# EAGLE design 68000_afterWireing (EAGLE 7.6.0)
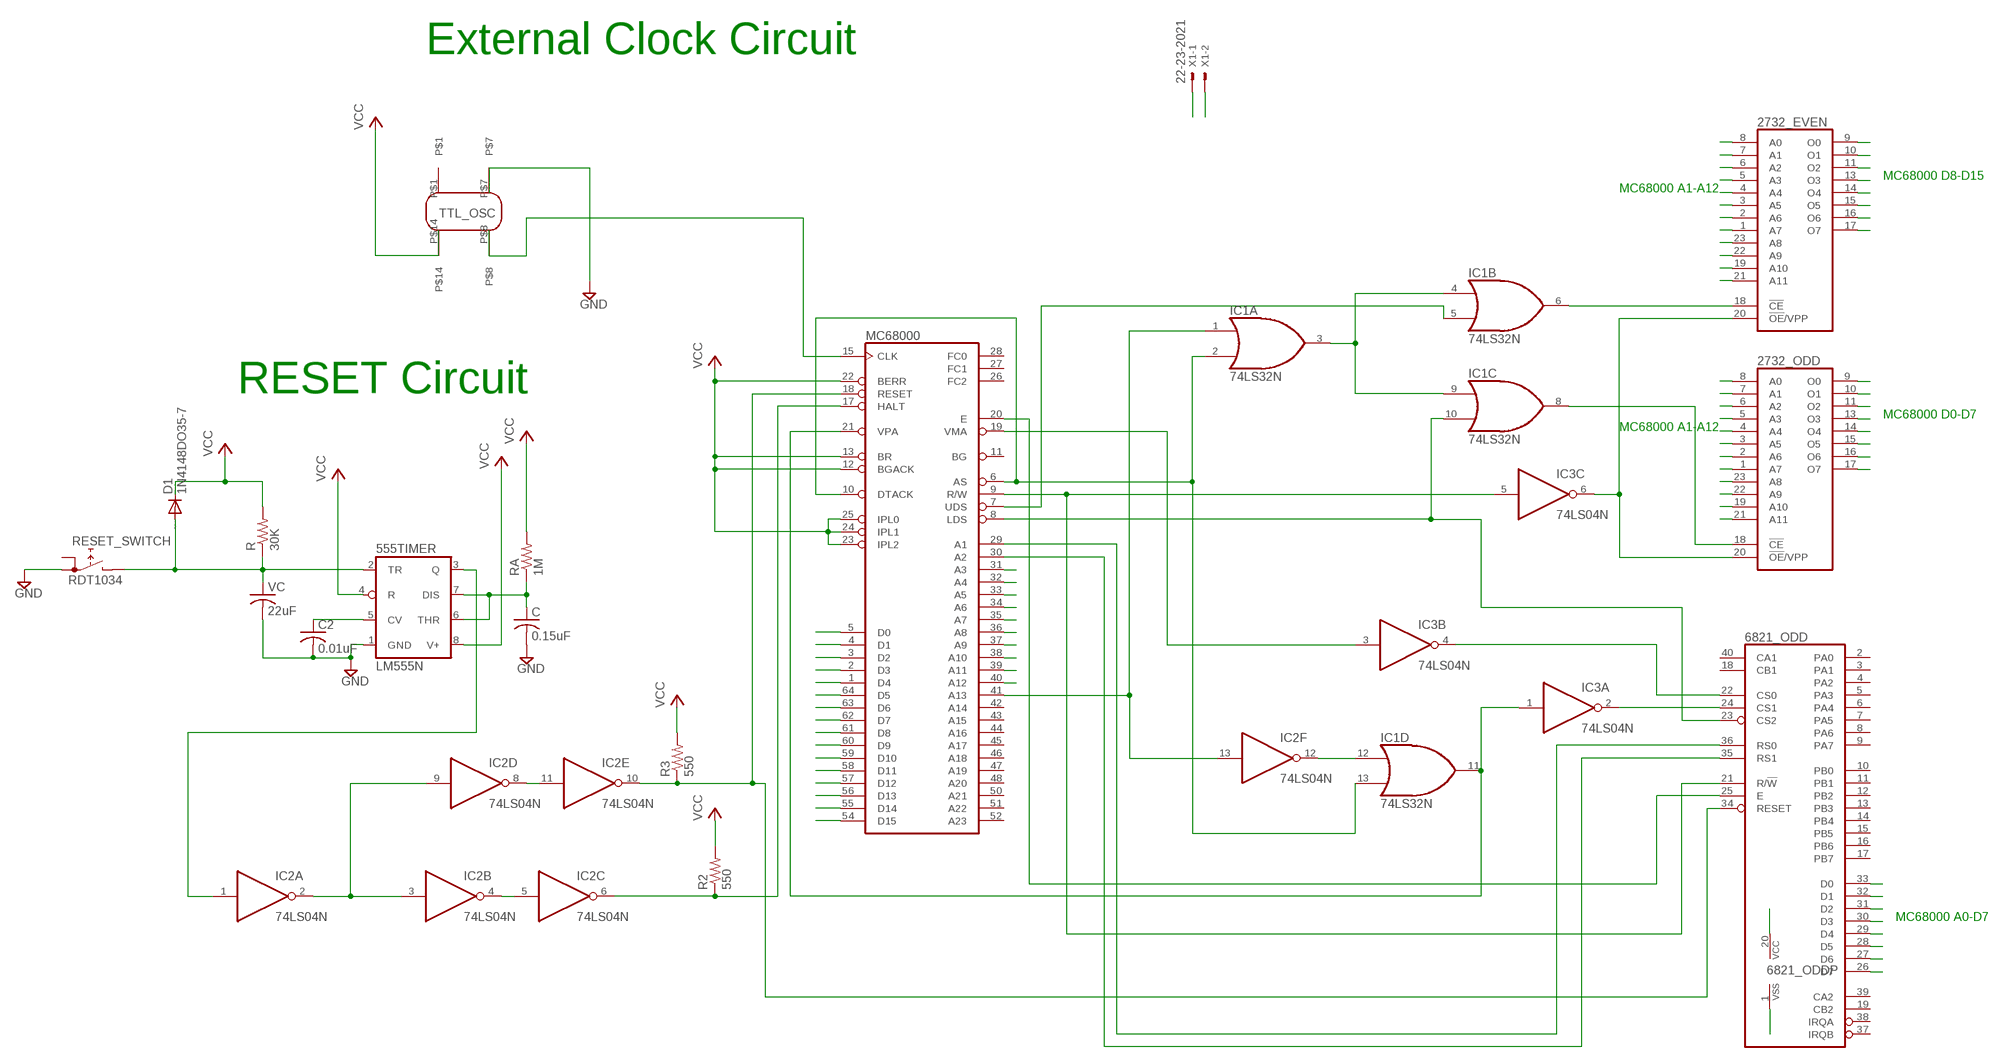
[diagram p0: schematic, sheet 1]

## Parts
555TIMER  LM555N  [DIL08]
2732_EVEN  2732  [DIL24]
2732_ODD  2732  [DIL24]
6821_ODD  6821  [DIL40]
C  0.15uF  C-US025-024X044  [C025-024X044]
C2  0.01uF  C-US025-024X044  [C025-024X044]
D1  1N4148DO35-7  [DO35-7]
IC1  74LS32N  [DIL14]
IC2  74LS04N  [DIL14]
IC3  74LS04N  [DIL14]
MC68000  MC68000P  [DIL64]
R  30K  R-US_0204/2V  [0204V]
R2  550  R-US_0204/2V  [0204V]
R3  550  R-US_0204/2V  [0204V]
RA  1M  R-US_0204/2V  [0204V]
RESET_SWITCH  RDT1034  [RDT1034]
U$1  TTL_OSCILLATOR  [TTL_OSCILLATOR]
VC  22uF  C-US025-024X044  [C025-024X044]
X1  22-23-2021  [22-23-2021]

## Nets
A1: 2732_EVEN.8(A0) 2732_ODD.8(A0) 6821_ODD.36(RS0) MC68000.29(A1)
A2: 2732_EVEN.7(A1) 2732_ODD.7(A1) 6821_ODD.35(RS1) MC68000.30(A2)
A3: 2732_EVEN.6(A2) 2732_ODD.6(A2) MC68000.31(A3)
A4: 2732_EVEN.5(A3) 2732_ODD.5(A3) MC68000.32(A4)
A5: 2732_EVEN.4(A4) 2732_ODD.4(A4) MC68000.33(A5)
A6: 2732_EVEN.3(A5) 2732_ODD.3(A5) MC68000.34(A6)
A7: 2732_EVEN.2(A6) 2732_ODD.2(A6) MC68000.35(A7)
A8: 2732_EVEN.1(A7) 2732_ODD.1(A7) MC68000.36(A8)
A9: 2732_EVEN.23(A8) 2732_ODD.23(A8) MC68000.37(A9)
A10: 2732_EVEN.22(A9) 2732_ODD.22(A9) MC68000.38(A10)
A11: 2732_EVEN.19(A10) 2732_ODD.19(A10) MC68000.39(A11)
A12: 2732_EVEN.21(A11) 2732_ODD.21(A11) MC68000.40(A12)
D0: 2732_ODD.9(O0) 6821_ODD.33(D0) MC68000.5(D0)
D1: 2732_ODD.10(O1) 6821_ODD.32(D1) MC68000.4(D1)
D2: 2732_ODD.11(O2) 6821_ODD.31(D2) MC68000.3(D2)
D3: 2732_ODD.13(O3) 6821_ODD.30(D3) MC68000.2(D3)
D4: 2732_ODD.14(O4) 6821_ODD.29(D4) MC68000.1(D4)
D5: 2732_ODD.15(O5) 6821_ODD.28(D5) MC68000.64(D5)
D6: 2732_ODD.16(O6) 6821_ODD.27(D6) MC68000.63(D6)
D7: 2732_ODD.17(O7) 6821_ODD.26(D7) MC68000.62(D7)
D8: 2732_EVEN.9(O0) MC68000.61(D8)
D9: 2732_EVEN.10(O1) MC68000.60(D9)
D10: 2732_EVEN.11(O2) MC68000.59(D10)
D11: 2732_EVEN.13(O3) MC68000.58(D11)
D12: 2732_EVEN.14(O4) MC68000.57(D12)
D13: 2732_EVEN.15(O5) MC68000.56(D13)
D14: 2732_EVEN.16(O6) MC68000.55(D14)
D15: 2732_EVEN.17(O7) MC68000.54(D15)
GND [ground]: 555TIMER.1(GND) 6821_ODD.1(VSS) C2.2 C.2 RESET_SWITCH.A1 U$1.P$7 VC.2 X1.2
N$1: 6821_ODD.21(R/!W) IC3.5(C:I) MC68000.9(R/W)
N$2: 6821_ODD.24(CS1) IC3.2(A:O)
N$3: IC1.1(A:I0) IC2.13(F:I) MC68000.41(A13)
N$4: IC1.3(A:O) IC1.4(B:I0) IC1.9(C:I0)
N$5: 2732_EVEN.20(!OE!/VPP) 2732_ODD.20(!OE!/VPP) IC3.6(C:O)
N$6: 6821_ODD.25(E) MC68000.20(E)
N$8: IC1.5(B:I1) MC68000.7(UDS)
N$9: 6821_ODD.23(CS2) IC1.10(C:I1) MC68000.8(LDS)
N$10: IC1.2(A:I1) IC1.13(D:I1) MC68000.6(AS) MC68000.10(DTACK)
N$11: 6821_ODD.22(CS0) IC3.4(B:O)
N$12: IC3.3(B:I) MC68000.19(VMA)
N$13: IC1.12(D:I0) IC2.12(F:O)
N$14: IC1.11(D:O) IC3.1(A:I) MC68000.21(VPA)
N$15: 555TIMER.5(CV) C2.1
N$16: 555TIMER.2(TR) D1.A R.1 RESET_SWITCH.B VC.1
N$17: 2732_EVEN.18(!CE) IC1.6(B:O)
N$18: 555TIMER.6(THR) 555TIMER.7(DIS) C.1 RA.1
N$19: 555TIMER.3(Q) IC2.1(A:I)
N$20: IC2.4(B:O) IC2.5(C:I)
N$21: IC2.6(C:O) MC68000.17(HALT) R2.1
N$22: 6821_ODD.34(RESET) IC2.10(E:O) MC68000.18(RESET) R3.1
N$23: 2732_ODD.18(!CE) IC1.8(C:O)
N$26: MC68000.15(CLK) U$1.P$8
N$27: IC2.2(A:O) IC2.3(B:I) IC2.9(D:I)
N$28: IC2.8(D:O) IC2.11(E:I)
VCC [ground]: 555TIMER.4(R) 555TIMER.8(V+) 6821_ODD.20(VCC) D1.C MC68000.12(BGACK) MC68000.13(BR) MC68000.22(BERR) MC68000.23(IPL2) MC68000.24(IPL1) MC68000.25(IPL0) R2.2 R3.2 R.2 RA.2 U$1.P$14 X1.1
Unconnected: 6821_ODD.2(PA0) 6821_ODD.3(PA1) 6821_ODD.4(PA2) 6821_ODD.5(PA3) 6821_ODD.6(PA4) 6821_ODD.7(PA5) 6821_ODD.8(PA6) 6821_ODD.9(PA7) 6821_ODD.10(PB0) 6821_ODD.11(PB1) 6821_ODD.12(PB2) 6821_ODD.13(PB3) 6821_ODD.14(PB4) 6821_ODD.15(PB5) 6821_ODD.16(PB6) 6821_ODD.17(PB7) 6821_ODD.18(CB1) 6821_ODD.19(CB2) 6821_ODD.37(IRQB) 6821_ODD.38(IRQA) 6821_ODD.39(CA2) 6821_ODD.40(CA1) IC3.8(D:O) IC3.9(D:I) IC3.10(E:O) IC3.11(E:I) IC3.12(F:O) IC3.13(F:I) MC68000.11(BG) MC68000.26(FC2) MC68000.27(FC1) MC68000.28(FC0) MC68000.42(A14) MC68000.43(A15) MC68000.44(A16) MC68000.45(A17) MC68000.46(A18) MC68000.47(A19) MC68000.48(A20) MC68000.50(A21) MC68000.51(A22) MC68000.52(A23) RESET_SWITCH.A U$1.P$1

## Notes on the sheet
- External Clock Circuit
- MC68000 D8-D15
- MC68000 A1-A12
- RESET Circuit
- MC68000 D0-D7
- MC68000 A1-A12
- MC68000 A0-D7

## Power pins joined to a net without a drawn wire
GND: 2732_EVEN.12(GND) 2732_ODD.12(GND) IC1.7(P:GND) IC2.7(P:GND) IC3.7(P:GND) MC68000.16(GND) MC68000.53(GND)
VCC: 2732_EVEN.24(VCC) 2732_ODD.24(VCC) IC1.14(P:VCC) IC2.14(P:VCC) IC3.14(P:VCC) MC68000.14(VCC) MC68000.49(VCC)

## Library data of the parts
555TIMER = linear:*555: TIMER
2732_EVEN 2732_ODD = memory:2732: MEMORY
6821_ODD = micro-motorola:6821: MICROCONTROLLER/MEMORY DEVICE; MF: NTE ELECTRONICS; MPN: NTE6821; OC_FARNELL: 1652403; OC_NEWARK: 29C4772
C C2 VC = rcl:C-US: CAPACITOR, American symbol
D1 = diode:1N4148: DIODE high speed (Philips)
IC1 = 74xx-us:74*32: Quad 2-input OR gate
IC2 IC3 = 74xx-us:74*04: Hex INVERTER
MC68000 = micro-mc68000:MC68000P: 68xxx PROCESSOR; OC_FARNELL: unknown; OC_NEWARK: unknown
R R2 R3 RA = resistor:R-US_: RESISTOR, American symbol
RESET_SWITCH = switch:RDT1034: PUSH SWITCH www.radiohm.com
U$1 = TTL_OSCILLATOR:TTL_OSCILLATOR
X1 = con-molex:22-23-2021: .100" (2.54mm) Center Header - 2 Pin; MF: MOLEX; MPN: 22-23-2021; OC_FARNELL: 1462926; OC_NEWARK: 25C3832

## Net classes
0 default: width 0.406 mm
1 ground: width 0.61 mm

## Board
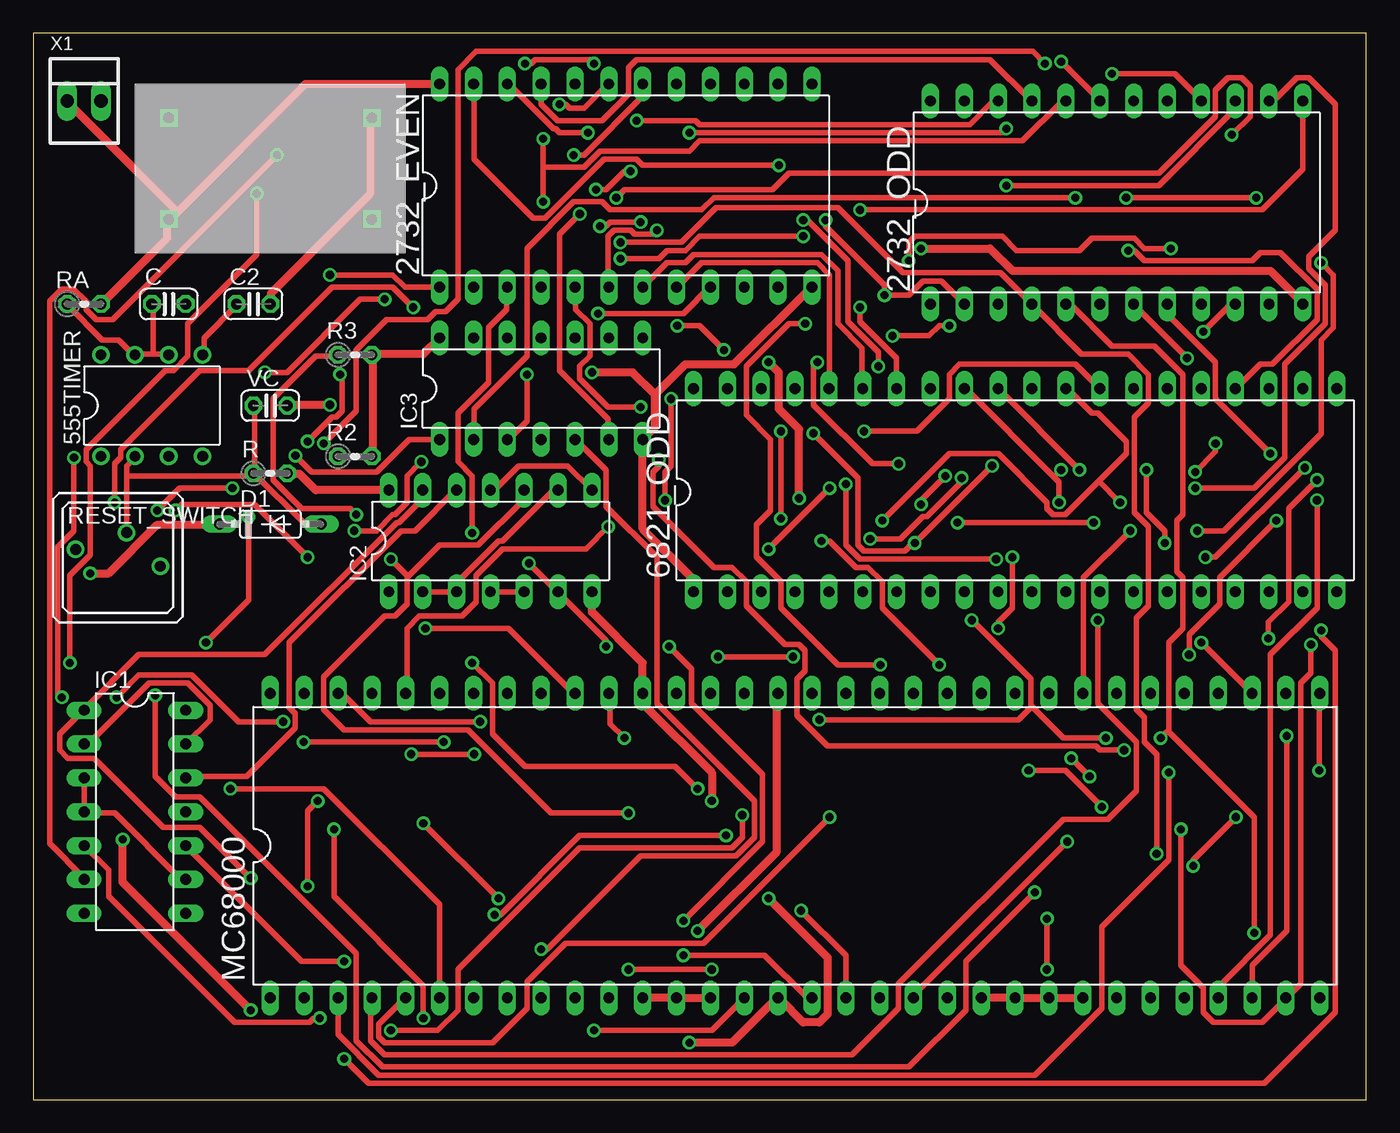
[diagram p1: board, top side]
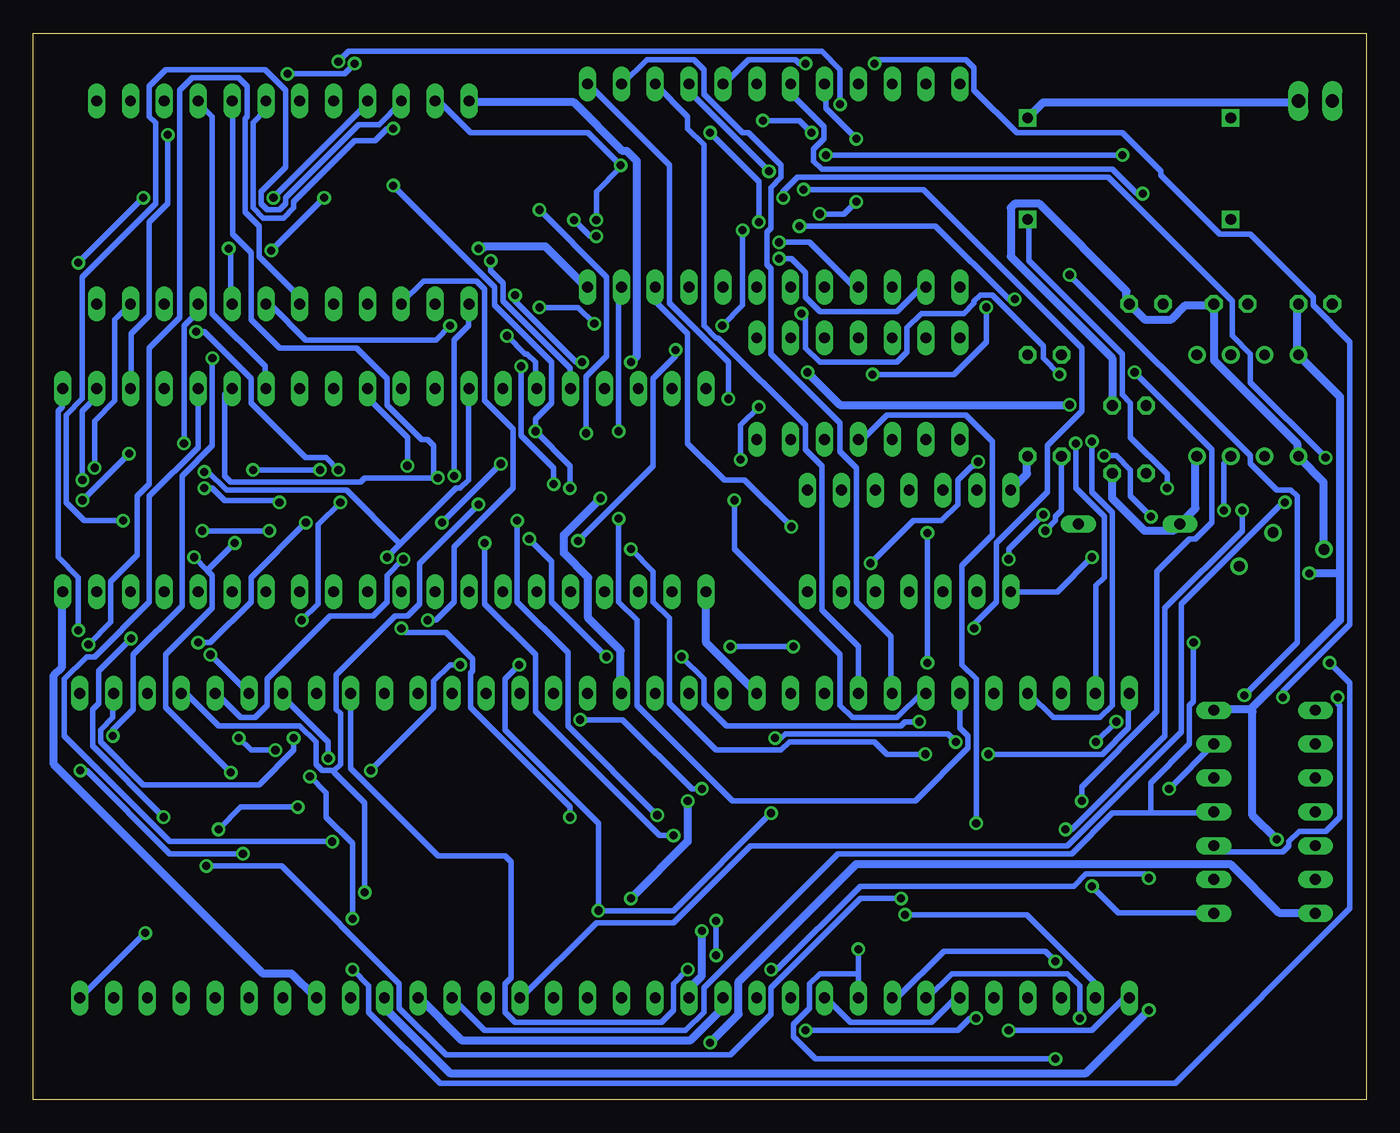
[diagram p2: board, bottom side, seen from below]

Size 100 x 80 mm. Coordinates in mm from the lower left corner, seen from the top.
Outline: 0,0 100,0 100,80 0,80 0,0
Copper layers (1*16): Top 0.035mm / dielectric 1.5mm / Bottom 0.035mm
Design rules "default": minimum track width 10mil, minimum drill 24mil, track to track 8mil, track to pad 8mil, pad to pad 8mil, via to via 8mil, smd to smd 8mil, copper to edge 40mil, drill to drill 8mil, minimum pad ring 10mil, minimum via ring 8mil, stop-mask expansion 4mil, vias tented up to drill 0mil, thermal gap 10mil

### Footprints (pad centres in the part's own frame; a part is rotated, then mirrored left to right if it is on the bottom)
DIL08 = drill 0.813 pad 1.27: 1 -3.81,-3.81; 2 -1.27,-3.81; 3 1.27,-3.81; 4 3.81,-3.81; 5 3.81,3.81; 6 1.27,3.81; 7 -1.27,3.81; 8 -3.81,3.81
DIL24 = drill 0.813 long: 1 -13.97,-7.62; 2 -11.43,-7.62; 3 -8.89,-7.62; 4 -6.35,-7.62; 5 -3.81,-7.62; 6 -1.27,-7.62; 7 1.27,-7.62; 8 3.81,-7.62; 9 6.35,-7.62; 10 8.89,-7.62; 11 11.43,-7.62; 12 13.97,-7.62; 13 13.97,7.62; 14 11.43,7.62; 15 8.89,7.62; 16 6.35,7.62; 17 3.81,7.62; 18 1.27,7.62; 19 -1.27,7.62; 20 -3.81,7.62; 21 -6.35,7.62; 22 -8.89,7.62; 23 -11.43,7.62; 24 -13.97,7.62
DIL40 = drill 0.813 long: 1 -24.13,-7.62; 2 -21.59,-7.62; 3 -19.05,-7.62; 4 -16.51,-7.62; 5 -13.97,-7.62; 6 -11.43,-7.62; 7 -8.89,-7.62; 8 -6.35,-7.62; 9 -3.81,-7.62; 10 -1.27,-7.62; 11 1.27,-7.62; 12 3.81,-7.62; 13 6.35,-7.62; 14 8.89,-7.62; 15 11.43,-7.62; 16 13.97,-7.62; 17 16.51,-7.62; 18 19.05,-7.62; 19 21.59,-7.62; 20 24.13,-7.62; 21 24.13,7.62; 22 21.59,7.62; 23 19.05,7.62; 24 16.51,7.62; 25 13.97,7.62; 26 11.43,7.62; 27 8.89,7.62; 28 6.35,7.62; 29 3.81,7.62; 30 1.27,7.62; 31 -1.27,7.62; 32 -3.81,7.62; 33 -6.35,7.62; 34 -8.89,7.62; 35 -11.43,7.62; 36 -13.97,7.62; 37 -16.51,7.62; 38 -19.05,7.62; 39 -21.59,7.62; 40 -24.13,7.62
C025-024X044 = drill 0.813 octagon: 1 -1.27,0; 2 1.27,0
DO35-7 = drill 0.813 long: A 3.81,0; C -3.81,0
DIL14 = drill 0.813 long: 1 -7.62,-3.81; 2 -5.08,-3.81; 3 -2.54,-3.81; 4 0,-3.81; 5 2.54,-3.81; 6 5.08,-3.81; 7 7.62,-3.81; 8 7.62,3.81; 9 5.08,3.81; 10 2.54,3.81; 11 0,3.81; 12 -2.54,3.81; 13 -5.08,3.81; 14 -7.62,3.81
DIL64 = drill 0.813 long: 1 -39.37,-11.43; 2 -36.83,-11.43; 3 -34.29,-11.43; 4 -31.75,-11.43; 5 -29.21,-11.43; 6 -26.67,-11.43; 7 -24.13,-11.43; 8 -21.59,-11.43; 9 -19.05,-11.43; 10 -16.51,-11.43; 11 -13.97,-11.43; 12 -11.43,-11.43; 13 -8.89,-11.43; 14 -6.35,-11.43; 15 -3.81,-11.43; 16 -1.27,-11.43; 17 1.27,-11.43; 18 3.81,-11.43; 19 6.35,-11.43; 20 8.89,-11.43; 21 11.43,-11.43; 22 13.97,-11.43; 23 16.51,-11.43; 24 19.05,-11.43; 25 21.59,-11.43; 26 24.13,-11.43; 27 26.67,-11.43; 28 29.21,-11.43; 29 31.75,-11.43; 30 34.29,-11.43; 31 36.83,-11.43; 32 39.37,-11.43; 33 39.37,11.43; 34 36.83,11.43; 35 34.29,11.43; 36 31.75,11.43; 37 29.21,11.43; 38 26.67,11.43; 39 24.13,11.43; 40 21.59,11.43; 41 19.05,11.43; 42 16.51,11.43; 43 13.97,11.43; 44 11.43,11.43; 45 8.89,11.43; 46 6.35,11.43; 47 3.81,11.43; 48 1.27,11.43; 49 -1.27,11.43; 50 -3.81,11.43; 51 -6.35,11.43; 52 -8.89,11.43; 53 -11.43,11.43; 54 -13.97,11.43; 55 -16.51,11.43; 56 -19.05,11.43; 57 -21.59,11.43; 58 -24.13,11.43; 59 -26.67,11.43; 60 -29.21,11.43; 61 -31.75,11.43; 62 -34.29,11.43; 63 -36.83,11.43; 64 -39.37,11.43
0204V = drill 0.813 octagon: 1 -1.27,0; 2 1.27,0
RDT1034 = drill 0.8: A 3.175,-0.635; A1 -3.175,0.635; B 0.65,1.9
TTL_OSCILLATOR = drill 0.8 square: P$1 2.54,10.16; P$7 17.78,10.16; P$8 17.78,2.54; P$14 2.54,2.54
22-23-2021 = drill 1 long: 1 -1.27,0; 2 1.27,0

### Placement (x,y rotation side)
555TIMER  8.89,52.07 0 top
2732_EVEN  44.45,68.58 0 top
2732_ODD  81.28,67.31 0 top
6821_ODD  73.66,45.72 0 top
C  10.16,59.69 0 top
C2  16.51,59.69 0 top
D1  17.78,43.18 0 top
IC1  7.62,21.59 270 top
IC2  34.29,41.91 0 top
IC3  38.1,53.34 0 top
MC68000  57.15,19.05 0 top
R  17.78,46.99 0 top
R2  24.13,48.26 0 top
R3  24.13,55.88 0 top
RA  3.81,59.69 0 top
RESET_SWITCH  6.35,40.64 0 top
U$1  7.62,63.5 0 top
VC  17.78,52.07 0 top
X1  3.81,74.93 0 top

### Tracks (layer width: path | path; a pad name or v marks a point on that pad's centre or on a via)
A1  (via drill 0.61)
  Top 0.406: 6821_ODD.36 59.74,53.34 59.74,61.87 58.83,62.79 50.14,62.79 48.31,60.96 2732_EVEN.8 | v85.34,63.86 83.36,63.86 82.6,64.62 79.4,64.62 78.49,63.7 73.76,63.7 72.69,64.77 66.14,64.77 65.68,64.31 v65.68,62.94 | v96.32,44.96 96.32,36.88 92.81,33.38 92.81,12.34 89,8.53 89,7.62 MC68000.29 | v92.81,48.46 88.7,52.58 88.7,55.32 85.19,58.83 85.19,59.59 2732_ODD.8
  Bottom 0.406: v85.34,63.86 85.19,63.7 85.19,59.74 2732_ODD.8 | v65.68,62.94 65.68,62.18 64.77,61.27 64.77,59.89 59.74,54.86 59.74,53.34 6821_ODD.36 | v92.81,48.46 v96.32,44.96
A2  (via drill 0.61)
  Top 0.406: 2732_EVEN.7 47.55,62.79 48.92,62.79 49.53,63.4 59.13,63.4 60.35,62.18 60.35,58.22 62.18,56.39 62.18,53.34 6821_ODD.35 | v68.73,58.06 67.97,58.06 67.21,57.3 v64.47,57.3 | MC68000.30 91.44,10.06 94.03,12.65 v94.03,27.28 | v86.56,55.63 82.6,59.59 2732_ODD.7
  Bottom 0.406: v68.73,58.06 69.8,57 79.55,57 82.14,59.59 82.45,59.59 2732_ODD.7 | v64.47,57.3 63.09,55.93 62.94,55.93 62.33,55.32 62.33,53.34 6821_ODD.35 | v94.03,27.28 94.03,27.74 92.51,29.26 92.51,33.38 88.85,37.03 88.85,46.79 86.56,49.07 v86.56,55.63
A3  (via drill 0.61)
  Top 0.406: v95.86,34.14 95.86,32 95.1,31.24 95.1,8.69 94.03,7.62 MC68000.31 93.88,7.47 92.2,5.79 88.54,5.79 87.78,6.55 87.78,8.38 86.11,10.06 v86.11,20.27 | v46.79,65.23 46.48,64.92 45.11,64.92 44.81,65.23 43.59,65.23 43.13,64.77 43.13,60.96 2732_EVEN.6 | v48.31,58.06 49.99,58.06 v51.82,56.24 | v59.13,41.91 59.74,41.91 61.72,39.93 62.64,39.93 63.7,38.86 63.7,36.88 v67.97,32.61 | v74.68,24.69 77.42,24.69 v80.16,21.95
  Bottom 0.406: 2732_ODD.6 80.01,60.2 83.06,63.25 83.06,65.53 84.12,66.6 84.12,73.61 83.97,73.76 83.97,76.05 84.58,76.66 88.09,76.66 89,75.74 89,58.67 91.29,56.39 91.29,46.18 92.2,45.26 92.2,40.84 94.18,38.86 94.18,35.81 v95.86,34.14 | v46.79,65.23 46.79,59.59 v48.31,58.06 | v51.82,56.24 51.82,55.78 53.49,54.1 53.49,47.55 v59.13,41.91 | v67.97,32.61 68.73,32.61 69.95,31.39 69.95,29.41 v74.68,24.69 | v80.16,21.95 84.43,21.95 v86.11,20.27
A4  (via drill 0.61)
  Top 0.406: 85.19,27.58 85.19,34.29 86.26,35.36 86.26,39.17 85.8,39.62 85.8,43.43 86.26,43.89 86.26,54.41 84.12,56.54 80.92,56.54 77.88,59.59 77.57,59.59 2732_ODD.5 | 85.19,27.58 91.59,21.18 v91.59,12.5 | v45.57,51.97 43.13,51.97 41,54.1 41,55.02 41.76,55.78 41.76,58.22 40.69,59.28 40.69,60.96 2732_EVEN.5 | v46.94,48.01 46.94,47.55 46.48,47.09 46.48,44.5 51.05,39.93 52.43,39.93 53.49,38.86 53.49,37.03 56.39,34.14 57.45,34.14 57.91,33.68 57.91,32.16 57.3,31.55 57.3,28.8 59.59,26.52 79.7,26.52 80.01,26.21 v81.84,26.21 | v84.58,27.13 85.04,27.58 85.19,27.58
  Bottom 0.406: v91.59,12.5 96.47,7.62 MC68000.32 | v45.57,51.97 46.94,50.6 v46.94,48.01 | v81.84,26.21 83.67,26.21 v84.58,27.13
A5  (via drill 0.61)
  Top 0.406: v96.47,24.69 96.47,30.48 MC68000.33 | v84.28,18.44 84.28,25.91 83.36,26.82 83.36,28.65 82.75,29.26 82.75,36.12 83.67,37.03 83.67,42.98 82.6,44.04 82.6,51.21 83.67,52.27 83.67,54.41 82.14,55.93 78.64,55.93 74.98,59.59 2732_ODD.4 74.83,59.74 72.54,62.03 65.23,62.03 60.35,66.9 51.21,66.9 48.62,64.31 v44.04,64.31
  Bottom 0.406: v96.47,24.69 96.01,24.69 89.76,18.44 v84.28,18.44 | 2732_EVEN.4 38.41,60.96 41.76,64.31 v44.04,64.31
A6  (via drill 0.61)
  Top 0.406: v80.47,27.13 77.27,27.13 74.91,29.49 | 74.91,29.49 74.83,29.57 74.83,31.55 v70.41,35.97 | v32.92,42.52 32.92,46.79 31.85,47.85 31.85,51.51 34.14,53.8 34.14,57.91 35.51,59.28 35.51,60.96 2732_EVEN.3 | v32.92,32.77 34.44,31.24 34.44,27.43 36.88,24.99 48.16,24.99 v49.84,23.32 | v58.98,28.5 73.91,28.5 74.91,29.49
  Bottom 0.406: v80.47,27.13 80.47,26.21 83.06,23.62 91.75,23.62 94.94,26.82 94.94,27.74 94.03,28.65 94.03,30.48 MC68000.34 | v70.41,35.97 69.8,35.97 68.43,37.34 68.43,41.45 64.01,45.87 64.01,50.29 66.14,52.43 66.14,60.81 66.75,61.42 70.71,61.42 72.39,59.74 2732_ODD.3 | v32.92,32.77 v32.92,42.52 | v49.84,23.32 50.6,23.32 55.78,28.5 v58.98,28.5
A7  (via drill 0.61)
  Top 0.406: v87.63,34.29 MC68000.35 | v69.34,43.28 v79.55,43.28 | v64.92,47.7 62.94,47.7 58.52,52.12 58.52,55.02 v58.83,55.32 | 2732_ODD.2 68.12,61.42 66.75,61.42 65.68,60.35 v63.86,60.35 63.86,61.11 59.44,65.53 v59.44,65.99 | v44.04,63.09 46.94,63.09 47.55,63.7 48.92,63.7 49.99,64.77 v57.76,64.77
  Bottom 0.406: v87.63,34.29 86.72,34.29 83.67,37.34 83.67,39.17 v79.55,43.28 | v64.92,47.7 v69.34,43.28 | v58.83,55.32 59.28,55.32 63.86,59.89 v63.86,60.35 | 2732_EVEN.2 33.38,60.96 35.2,59.13 41,59.13 42.06,60.2 42.06,62.03 43.13,63.09 v44.04,63.09 | v57.76,64.77 58.22,64.77 v59.44,65.99
A8  (via drill 0.61)
  Top 0.406: v66.6,44.65 66.6,44.96 v68.43,46.79 | 2732_EVEN.1 27.89,60.96 26.98,61.87 v22.25,61.87 | v9.14,30.33 9.14,24.23 10.67,22.71 12.5,22.71 24.23,10.97 24.23,4.42 26.21,2.44 65.68,2.44 69.95,6.71 69.95,10.36 v75.13,15.54
  Bottom 0.406: MC68000.36 88.54,30.48 86.11,28.04 80.01,28.04 78.79,26.82 78.79,25.15 78.33,24.69 77.42,24.69 | 77.42,24.69 76.96,25.15 76.96,28.96 77.27,29.26 77.27,31.85 72.85,36.27 71.93,36.27 71.02,37.19 71.02,40.23 v66.6,44.65 | v68.43,46.79 68.43,57 67.36,58.06 67.36,59.59 2732_ODD.1 | v22.25,61.87 8.69,48.31 8.69,47.7 6.71,45.72 5.64,45.72 5.18,45.26 5.18,34.29 v9.14,30.33 | v75.13,15.54 75.13,22.25 77.42,24.54 77.42,24.69
A9  (via drill 0.61)
  Top 0.406: v55.93,70.1 45.72,70.1 45.26,70.56 42.82,70.56 38.41,66.14 37.49,66.14 33.07,70.56 33.07,76.2 2732_EVEN.23 | v72.24,40.54 62.03,40.54 60.96,41.6 v60.96,46.18 | v63.4,55.02 63.4,56.08 61.11,58.37 61.11,62.94 58.06,65.99 v57.76,65.99
  Bottom 0.406: 2732_ODD.23 69.8,74.83 69.49,74.83 67.21,72.54 58.37,72.54 v55.93,70.1 55.93,69.95 57.76,68.12 v57.76,65.99 | v72.24,40.54 73.46,39.32 73.46,37.34 74.52,36.27 77.72,36.27 82.45,31.55 82.45,29.57 83.36,28.65 84.43,28.65 86.26,30.48 MC68000.37 | v60.96,46.18 60.96,47.4 63.4,49.84 v63.4,55.02
A10  (via drill 0.61)
  Top 0.406: v45.26,73.46 49.68,73.46 49.99,73.15 70.26,73.15 71.93,74.83 72.39,74.83 2732_ODD.22 | v41.6,72.54 39.47,72.54 39.17,72.85 39.01,72.85 35.66,76.2 2732_EVEN.22 | v86.72,33.38 86.72,34.9 89,37.19 89,39.17 v93.27,43.43
  Bottom 0.406: v45.26,73.46 42.52,73.46 v41.6,72.54 | v86.72,33.38 MC68000.38 | v93.27,43.43 96.16,43.43 97.54,44.81 97.54,51.36 96.32,52.58 96.32,61.72 90.83,67.21 90.83,73.3 91.29,73.76 91.29,76.05 90.07,77.27 82.6,77.27 81.08,75.74 81.08,69.95 82.91,68.12 82.91,67.21 82.45,66.75 81.53,66.75 81.08,67.21 81.08,67.67 75.59,73.15 74.07,73.15 72.39,74.83 2732_ODD.22
A11  (via drill 0.61)
  Top 0.406: v79.25,24.23 v77.88,25.6 | v76.05,9.75 v76.05,13.56 | v2.74,32.77 2.74,39.32 4.27,40.84 4.27,47.55 3.96,47.85 3.96,48.77 9.91,54.71 10.52,54.71 11.58,55.78 11.58,58.22 16.76,63.4 v16.76,67.97 | v77.11,77.88 80.01,74.98 2732_ODD.19 | v39.47,74.68 39.93,74.68 40.23,74.37 41.3,74.37 43.13,76.2 2732_EVEN.19
  Bottom 0.406: v77.88,25.6 77.88,26.82 81.23,30.18 81.23,30.48 MC68000.39 | v79.25,24.23 78.03,23.01 78.03,21.18 76.05,19.2 v76.05,13.56 | v76.05,9.75 74.83,8.53 74.83,6.55 69.49,1.22 14.33,1.22 1.22,14.33 1.22,31.24 v2.74,32.77 | v16.76,67.97 17.22,67.97 19.05,69.8 40.84,69.8 41.45,70.41 41.45,71.32 40.69,72.08 40.69,73 43.13,75.44 43.13,76.2 2732_EVEN.19 | v77.11,77.88 76.35,78.64 40.84,78.64 39.47,77.27 v39.47,74.68
A12  (via drill 0.61)
  Top 0.406: v82.3,42.67 78.79,39.17 78.79,30.48 MC68000.40 | v87.33,42.67 89.31,42.67 96.62,49.99 96.62,57 97.54,57.91 97.54,61.87 v96.62,62.79 | v81.99,67.67 v91.75,67.67 | 2732_EVEN.21 38.1,74.68 39.32,73.46 42.67,73.46 44.65,75.44 44.65,77.42 45.26,78.03 71.78,78.03 74.83,74.98 2732_ODD.21
  Bottom 0.406: v87.33,42.67 v82.3,42.67 | v91.75,67.67 v96.62,62.79 | v81.99,67.67 74.83,74.83 2732_ODD.21
D0  (via drill 0.61)
  Top 0.406: v59.74,21.18 50.29,11.73 39.93,11.73 37.03,8.84 37.03,6.86 34.44,4.27 26.36,4.27 25.91,4.72 25.91,5.64 27.89,7.62 MC68000.5 | v72.39,35.36 72.39,35.81 73.46,36.88 v73.46,40.69 | v88.7,49.23 88.7,48.62 v87.17,47.09
  Bottom 0.406: v59.74,21.18 59.74,21.95 67.21,29.41 67.21,32 67.06,32.16 67.06,33.07 69.04,35.05 72.08,35.05 v72.39,35.36 | 72.47,41.68 68.28,45.87 67.97,45.87 67.36,46.48 67.36,53.34 6821_ODD.33 | 72.47,41.68 v73.46,40.69 | 2732_ODD.9 87.63,59.13 88.7,58.06 v88.7,49.23 | v87.17,47.09 86.87,47.09 85.5,45.72 76.5,45.72 72.47,41.68
D1  (via drill 0.61)
  Top 0.406: v79.86,35.97 79.86,29.72 82.75,26.82 82.75,23.16 80.62,21.03 77.27,21.03 64.92,8.69 64.92,6.86 61.42,3.35 26.36,3.35 25.3,4.42 25.3,7.62 MC68000.4 | v76.96,44.81 76.96,46.33 76.58,46.71 | 76.58,46.71 69.95,53.34 6821_ODD.32 | v87.78,57.61 89.76,59.59 90.07,59.59 2732_ODD.10 | 76.58,46.71 v77.11,47.24
  Bottom 0.406: v79.86,35.97 78.64,37.19 78.64,43.13 v76.96,44.81 | v87.78,57.61 87.17,57.61 83.67,54.1 83.67,52.27 79.55,48.16 78.03,48.16 v77.11,47.24
D2  (via drill 0.61)
  Top 0.406: MC68000.3 22.86,4.88 25.91,1.83 75.13,1.83 80.16,6.86 80.16,12.95 85.19,17.98 v85.19,24.54 | v87.94,40.69 88.7,40.69 v95.4,47.4 | v78.49,47.24 6821_ODD.31 | v83.52,47.24 83.52,44.04 84.89,42.67 v84.89,41.76
  Bottom 0.406: v85.19,24.54 90.07,29.41 90.07,33.38 86.56,36.88 86.56,39.32 86.94,39.7 | v87.94,40.69 86.94,39.7 | v95.4,47.4 95.4,50.9 93.88,52.43 93.88,58.52 2732_ODD.11 | v83.52,47.24 v78.49,47.24 | 86.94,39.7 v84.89,41.76
D3  (via drill 0.61)
  Top 0.406: v34.59,13.87 35.05,13.87 41,19.81 v51.97,19.81 | v71.93,47.55 v66.14,41.76 65.99,41.76 65.38,41.15 62.33,41.15 61.87,41.6 61.87,46.63 v58.52,49.99 | 2732_ODD.13 95.25,69.8 92.2,66.75 v62.03,66.75
  Bottom 0.406: v34.59,13.87 25.45,13.87 20.42,8.84 20.42,7.62 MC68000.2 | v51.97,19.81 53.03,19.81 62.33,29.11 62.33,33.38 66.14,37.19 v66.14,41.76 | v71.93,47.55 71.93,49.68 74.83,52.58 74.83,53.34 6821_ODD.30 | v62.03,66.75 57,61.72 57,55.78 58.52,54.25 v58.52,49.99
D4  (via drill 0.61)
  Top 0.406: v26.82,5.18 30.33,5.18 31.85,6.71 31.85,9.75 41,18.9 52.43,18.9 53.19,19.66 v53.19,21.34 | v63.7,43.43 68.73,48.46 72.39,48.46 76.05,44.81 76.05,44.35 76.5,43.89 77.42,43.89 79.93,46.41 | 79.93,46.41 81.99,48.46 81.99,49.38 79.86,51.51 79.4,51.51 77.57,53.34 6821_ODD.29 | v87.17,45.87 91.59,45.87 93.88,48.16 93.88,55.17 96.93,58.22 96.93,61.11 95.71,62.33 95.71,63.25 97.69,65.23 97.69,74.68 95.71,76.66 94.79,76.66 93.12,74.98 92.81,74.98 2732_ODD.14 | 79.93,46.41 v81.53,44.81
  Bottom 0.406: MC68000.1 18.14,7.62 20.57,5.18 v26.82,5.18 | v53.19,21.34 59.89,28.04 59.89,33.53 63.7,37.34 v63.7,43.43 | v87.17,45.87 86.56,45.87 85.65,44.96 81.69,44.96 v81.53,44.81
D5  (via drill 0.61)
  Top 0.406: v33.07,25.91 v28.35,25.91 | v59.74,45.87 v55.17,41.3 | v62.33,50.14 66.29,50.14 68.73,52.58 68.73,54.41 69.49,55.17 78.18,55.17 6821_ODD.28 | v73,68.58 84.43,68.58 90.07,74.22 90.07,74.83 2732_ODD.15
  Bottom 0.406: v28.35,25.91 19.81,25.91 17.83,27.89 17.83,30.48 MC68000.64 | v33.07,25.91 35.97,25.91 36.88,26.82 43.28,26.82 43.89,26.21 48.77,26.21 52.27,29.72 52.27,36.12 53.49,37.34 53.49,39.62 v55.17,41.3 | v59.74,45.87 59.74,47.55 v62.33,50.14 62.33,51.05 61.11,52.27 61.11,55.32 65.38,59.59 65.38,60.96 v73,68.58
D6  (via drill 0.61)
  Top 0.406: v21.79,49.23 24.23,51.66 24.23,56.24 26.52,58.52 29.57,58.52 30.18,59.13 30.94,59.13 31.85,60.05 31.85,77.27 33.22,78.64 74.98,78.64 v75.89,77.72 | v80.92,76.96 85.65,76.96 87.63,74.98 2732_ODD.16
  Bottom 0.406: v21.79,49.23 21.79,45.87 19.66,43.74 19.66,39.17 20.27,38.56 20.27,30.48 MC68000.63 | v75.89,77.72 76.66,76.96 v80.92,76.96 | 6821_ODD.27 82.6,53.34 82.6,55.02 86.56,58.98 86.56,73.76 87.63,74.83 2732_ODD.16
D7  (via drill 0.61)
  Top 0.406: MC68000.62 23.16,30.48 25.3,28.35 v33.53,28.35 | v57,33.22 v51.36,33.22 | v62.79,42.06 65.08,42.06 66.75,43.74 67.06,43.74 69.65,46.33 v69.65,46.63
  Bottom 0.406: v33.53,28.35 34.59,28.35 34.9,28.04 48.01,28.04 49.68,29.72 49.68,31.55 v51.36,33.22 | v57,33.22 61.11,37.34 61.11,40.39 v62.79,42.06 | 6821_ODD.26 85.19,53.34 85.65,52.88 85.65,46.79 85.19,46.33 75.44,46.33 75.13,46.63 v69.65,46.63 69.95,46.79 69.95,49.07 70.41,49.53 70.87,49.53 73.46,52.12 73.46,54.1 75.74,56.39 81.53,56.39 83.67,58.52 83.67,63.55 85.04,64.92 85.04,74.83 2732_ODD.17
D8  (via drill 0.61)
  Top 0.406: v20.57,49.38 22.4,51.21 22.71,51.21 23.16,51.66 23.16,54.25 v23.01,54.41 | v42.37,58.98 48.77,58.98 50.75,60.96 2732_EVEN.9
  Bottom 0.406: v20.57,49.38 20.57,45.57 19.05,44.04 19.05,29.57 19.96,28.65 23.47,28.65 25.3,30.48 MC68000.61 | v23.01,54.41 24.23,55.63 24.23,56.54 28.04,60.35 28.96,60.35 29.41,59.89 29.41,59.74 30.18,58.98 33.38,58.98 34.44,57.91 34.44,56.08 35.2,55.32 41,55.32 42.06,56.39 42.06,58.67 v42.37,58.98
D9  (via drill 0.61)
  Top 0.406: v43.13,42.98 41.45,41.3 35.2,41.3 33.22,39.32 33.22,37.34 32.16,36.27 28.96,36.27 28.04,35.36 28.04,30.48 MC68000.60
  Bottom 0.406: v43.13,42.98 46.63,46.48 48.16,46.48 50.9,49.23 50.9,57.45 53.34,59.89 2732_EVEN.10
D10  (via drill 0.61)
  Top 0.406: v56.08,50.14 v56.08,43.59
  Bottom 0.406: MC68000.59 30.48,27.89 29.87,27.28 29.87,26.36 33.83,22.4 47.55,22.4 54.71,29.57 54.71,35.97 56.08,37.34 v56.08,43.59 | v56.08,50.14 56.08,60.81 55.93,60.96 2732_EVEN.11
D11  (via drill 0.61)
  Top 0.406: v47.4,44.96 47.4,47.09 47.85,47.55 v47.85,52.58
  Bottom 0.406: MC68000.58 33.38,30.48 35.2,28.65 38.56,28.65 39.47,29.57 39.47,33.38 47.4,41.3 v47.4,44.96 | v47.85,52.58 47.85,55.32 52.27,59.74 52.27,70.1 58.37,76.2 2732_EVEN.13
D12
  Bottom 0.406: MC68000.57 35.66,30.48 35.66,34.75 38.25,37.34 38.25,47.4 39.47,48.62 39.47,50.75 44.65,55.93 44.65,62.33 44.96,62.64 44.96,65.08 44.65,65.38 44.65,68.43 43.89,69.19 43.89,70.1 46.33,72.54 46.79,72.54 49.68,75.44 49.68,77.27 50.44,78.03 53.95,78.03 55.78,76.2 2732_EVEN.14
D13
  Bottom 0.406: MC68000.56 38.1,33.98 40.84,36.73 40.84,47.55 42.06,48.77 42.06,50.6 48.62,57.15 48.77,57.15 49.68,58.06 49.68,71.63 50.9,72.85 50.9,73.76 2732_EVEN.15
D14  (via drill 0.61)
  Top 0.406: v29.41,35.36 35.66,35.36 40.54,30.48 MC68000.55 | v42.22,68.28 42.98,68.28 44.35,69.65 v44.81,69.65
  Bottom 0.406: v29.41,35.36 29.41,35.66 27.74,37.34 27.74,41.76 23.93,45.57 23.93,49.07 21.34,51.66 21.34,56.39 33.22,68.28 v42.22,68.28 | v44.81,69.65 50.75,75.59 50.75,76.2 2732_EVEN.16
D15  (via drill 0.61)
  Top 0.406: v44.35,27.13 43.28,28.19 43.28,30.48 MC68000.54 | v20.27,26.82 v30.79,26.82 | v18.75,28.35 15.39,28.35 11.89,31.85 7.92,31.85 v6.25,30.18 | v36.88,77.72 37.34,77.72 37.64,78.03 41.76,78.03 v42.06,77.72
  Bottom 0.406: v44.35,27.13 43.89,27.13 43.59,27.43 31.39,27.43 v30.79,26.82 | v18.75,28.35 v20.27,26.82 | v6.25,30.18 6.25,30.63 1.22,35.66 1.22,56.84 3.96,59.59 3.96,60.2 8.69,64.92 10.97,64.92 15.39,69.34 15.39,69.65 18.29,72.54 26.21,72.54 29.41,75.74 29.41,77.42 30.02,78.03 36.58,78.03 v36.88,77.72 | v42.06,77.72 42.52,77.72 42.82,78.03 46.33,78.03 48.16,76.2 2732_EVEN.17
GND  (via drill 0.61)
  Top 0.61: v49.23,4.27 52.43,4.27 55.78,7.62 MC68000.16 56.08,7.47 57.76,5.79 58.98,5.79 59.59,6.4 59.59,10.67 v55.17,15.09 | U$1.P$7 25.3,73.61 25.3,67.97 17.83,60.5 17.83,59.74 C2.2 | IC2.7 41.91,36.58 45.72,32.77 MC68000.53 45.87,30.33 45.87,29.57 50.9,24.54 v50.9,22.4 | 6821_ODD.1 49.53,39.01 45.72,42.82 IC3.7 46.63,50.44 46.63,52.88 | 46.63,52.88 48.92,55.17 52.58,55.17 58.37,60.96 2732_EVEN.12 | v66.6,63.86 71.78,63.86 73.46,62.18 92.81,62.18 95.25,59.74 2732_ODD.12 | v22.25,52.12 19.05,52.12 VC.2 | v41.91,54.56 44.96,54.56 46.63,52.88
  Bottom 0.61: v49.23,4.27 47.09,6.4 47.09,8.84 38.25,17.68 10.21,17.68 6.55,14.02 3.81,14.02 IC1.7 | RESET_SWITCH.A1 3.2,41.3 3.2,46.33 5.03,48.16 555TIMER.1 5.18,48.46 5.18,49.23 11.43,55.47 C.2 11.43,59.59 13.56,59.59 14.63,58.52 16.61,58.52 C2.2 17.98,59.89 17.98,60.66 24.54,67.21 26.36,67.21 26.67,66.9 26.67,63.25 19.05,55.63 VC.2 | U$1.P$7 24.23,74.83 5.18,74.83 X1.2 | 6821_ODD.1 49.53,34.29 MC68000.53 | v66.6,63.86 66.29,63.86 66.14,64.01 61.57,64.01 58.52,60.96 2732_EVEN.12 | v22.25,52.12 39.47,52.12 v41.91,54.56 | v55.17,15.09 50.9,19.36 v50.9,22.4
N$1  (via drill 0.61)
  Top 0.406: v38.1,11.28 38.56,11.28 45.57,18.29 52.73,18.29 54.1,19.66 54.1,22.4 46.79,29.72 46.79,40.69 42.98,44.5 42.98,47.24 40.69,49.53 IC3.5 | v96.62,35.2 96.62,34.75 97.69,33.68 97.69,6.55 92.35,1.22 25.15,1.22 v23.32,3.05
  Bottom 0.406: v38.1,11.28 38.1,9.45 | 38.1,9.45 MC68000.9 | v96.62,35.2 96.62,39.17 98.15,40.69 98.15,51.66 97.84,51.97 97.84,53.34 6821_ODD.21 | v23.32,3.05 41.3,3.05 42.98,4.72 42.98,5.64 41.76,6.86 41.76,8.69 41,9.45 38.1,9.45
N$2  (via drill 0.61)
  Top 0.406: v78.18,67.67 51.05,67.67 50.14,66.75 43.28,66.75 42.67,67.36 40.54,67.36 37.03,63.86 37.03,55.78 33.07,51.82 33.07,49.53 IC3.2 | v82.14,63.7 82.6,63.7 83.36,62.94 91.44,62.94 92.05,63.55 93.57,63.55 96.32,60.81 96.32,58.52 92.96,55.17 92.05,55.17 90.22,53.34 6821_ODD.24
  Bottom 0.406: v82.14,63.7 v78.18,67.67
N$3  (via drill 0.61)
  Top 0.406: IC2.13 29.11,45.72 29.11,44.96 27.43,43.28 27.28,43.28 17.37,33.38 7.92,33.38 3.81,29.26 IC1.1 3.66,29.11 1.98,27.43 1.98,26.21 2.59,25.6 4.57,25.6 9.75,20.42 12.5,20.42 v16.31,16.61 | v44.65,9.75 v50.9,9.75
  Bottom 0.406: MC68000.41 76.2,24.84 69.65,18.29 64.62,18.29 64.16,17.83 64.16,9.14 64.62,8.69 64.62,6.55 63.86,5.79 52.88,5.79 51.97,6.71 51.97,8.69 v50.9,9.75 | v44.65,9.75 44.2,9.75 37.95,16 21.95,16 21.03,16.92 16.61,16.92 v16.31,16.61
N$4
  Top 0.406: IC1.9 11.43,16.61 10.97,16.61 6.1,21.49 3.81,21.49 IC1.4 IC1.3
N$5  (via drill 0.61)
  Top 0.406: v41,66.45 39.47,64.92 39.47,54.71 43.13,51.05 43.13,49.53 IC3.6 | v38.25,72.08 38.25,69.95 | 38.25,69.95 v38.25,67.36 | 38.25,69.95 41.3,69.95 42.52,71.17 49.23,71.17 49.99,71.93 74.22,71.93 77.11,74.83 77.42,74.83 2732_ODD.20
  Bottom 0.406: v41,66.45 39.17,66.45 v38.25,67.36 | v38.25,72.08 40.54,74.37 40.54,76.2 2732_EVEN.20
N$6  (via drill 0.61)
  Top 0.406: v77.57,19.36 66.14,7.92 66.14,7.62 MC68000.20
  Bottom 0.406: v77.57,19.36 89.76,19.36 97.69,27.28 97.69,31.55 96.01,33.22 95.4,33.22 91.29,37.34 91.29,45.26 87.63,48.92 6821_ODD.25
N$8  (via drill 0.61)
  Top 0.406: v21.49,6.1 21.03,6.1 20.73,5.79 15.09,5.79 5.64,15.24 5.64,17.22 IC1.5
  Bottom 0.406: v21.49,6.1 21.49,8.53 22.4,9.45 31.09,9.45 32.92,7.62 MC68000.7
N$9  (via drill 0.61)
  Top 0.406: v23.32,10.36 20.12,10.36 IC1.10 | v89.92,72.39 91.29,73.76 91.29,76.05 90.68,76.66 89.61,76.66 88.7,75.74 88.7,73.76 84.43,69.49 56.69,69.49 55.47,68.28 44.35,68.28 v43.74,67.67 | v3.05,48.16 3.05,42.67 1.83,41.45 1.83,30.48 v2.13,30.18
  Bottom 0.406: MC68000.8 35.2,7.62 31.7,11.12 24.08,11.12 v23.32,10.36 | v89.92,72.39 89.92,67.21 91.29,65.84 91.29,58.83 92.66,57.45 92.66,53.34 6821_ODD.23 | v43.74,67.67 43.74,68.12 42.67,69.19 19.36,69.19 10.06,59.89 10.06,57.3 8.69,55.93 8.69,53.8 v3.05,48.16 | v2.13,30.18 2.13,29.72 1.98,29.57 1.98,21.18 3.05,20.12 5.03,20.12 5.79,19.36 5.79,19.05 6.25,18.59 10.97,18.59 IC1.10
N$10  (via drill 0.61)
  Top 0.406: IC1.2 4.12,26.67 8.69,31.24 11.58,31.24 13.26,29.57 13.26,28.5 IC1.13 | MC68000.6 30.48,14.63 21.79,23.32 v14.78,23.32
  Bottom 0.406: MC68000.6 30.79,7.62 32.61,5.79 38.71,5.79 40.54,7.62 MC68000.10 | IC1.13 v14.78,23.32
N$11  (via drill 0.61)
  Top 0.406: v34.9,15.09 v29.26,20.73 | v87.02,17.53 87.02,17.98 v90.22,21.18 | v92.66,34.59 92.66,35.81 94.18,37.34 94.18,44.35 v96.32,46.48
  Bottom 0.406: IC3.4 37.8,49.53 35.97,51.36 30.02,51.36 28.04,49.38 28.04,42.37 30.33,40.08 30.33,32.61 29.26,31.55 v29.26,20.73 | v34.9,15.09 37.95,15.09 44.65,8.38 44.65,6.4 47.7,3.35 69.04,3.35 72.54,6.86 72.54,8.69 81.38,17.53 v87.02,17.53 | v90.22,21.18 95.56,26.52 95.56,29.26 95.1,29.72 95.1,32.16 v92.66,34.59 | v96.32,46.48 96.32,51.66 95.25,52.73 6821_ODD.22
N$12  (via drill 0.61)
  Top 0.406: v6.1,44.81 6.1,47.7 6.55,48.16 6.55,48.77 12.5,54.71 16.15,54.71 22.4,60.96 26.98,60.96 v28.5,59.44 | v37.03,54.41 37.03,50.9 35.66,49.53 IC3.3
  Bottom 0.406: v6.1,44.81 6.25,44.81 13.87,37.19 13.87,27.58 22.4,19.05 46.18,19.05 51.97,13.26 57.76,13.26 63.4,7.62 MC68000.19 | v28.5,59.44 28.5,56.84 30.94,54.41 v37.03,54.41
N$13
  Top 0.406: IC1.12 11.43,24.23 16,24.23 19.66,27.89 19.66,28.96 19.2,29.41 19.2,34.29 27.58,42.67 28.65,42.67 31.7,45.72 IC2.12
N$14  (via drill 0.61)
  Top 0.406: IC3.1 28.19,49.53 25.76,47.09 20.88,47.09 v19.66,48.31 | v16.15,43.74 16.15,37.49 v12.95,34.29
  Bottom 0.406: 16.15,21.49 19.05,21.49 22.1,18.44 39.62,18.44 49.68,8.38 49.68,6.55 51.05,5.18 66.14,5.18 MC68000.21 | 16.15,21.49 11.43,21.49 IC1.11 | v19.66,48.31 18.75,48.31 17.68,47.24 17.68,45.26 v16.15,43.74 | v12.95,34.29 12.95,29.87 13.26,29.57 13.26,26.67 16.15,23.77 16.15,21.49
N$15
  Top 0.406: 555TIMER.5 12.8,55.93 12.8,57.15 15.24,59.59 C2.1
N$16
  Top 0.406: 7.01,46.79 7.01,47.55 7.62,48.16 555TIMER.2 | 7.01,46.79 7.01,42.67 RESET_SWITCH.B | R.1 16.61,47.09 16.61,51.97 VC.1 | D1.A 21.49,43.28 20.27,43.28 16.61,46.94 R.1 | 7.01,46.79 16.61,46.79 R.1
N$17  (via drill 0.61)
  Top 0.406: v18.29,70.87 5.94,58.52 4.72,58.52 3.96,59.28 3.96,59.89 3.05,60.81 2.13,60.81 1.22,59.89 1.22,19.2 3.81,16.61 IC1.6 | v40.54,70.87 41.3,70.87 45.72,75.29 2732_EVEN.18
  Bottom 0.406: v40.54,70.87 v18.29,70.87
N$18
  Top 0.406: 8.99,55.93 10.06,55.93 555TIMER.6 | 8.99,55.93 7.62,55.93 555TIMER.7 7.47,55.93 6.4,57 5.18,57 2.59,59.59 RA.1 | 8.99,55.93 8.99,59.59 C.1
N$19  (via drill 0.61)
  Top 0.406: v20.57,40.69 16.61,44.65 11.12,44.65 v10.67,44.2
  Bottom 0.406: IC2.1 23.16,38.1 v20.57,40.69 | v10.67,44.2 10.67,47.7 10.21,48.16 555TIMER.3
N$20
  Top 0.406: IC2.5 IC2.4
N$21  (via drill 0.61)
  Top 0.406: v24.08,42.67 25.76,42.67 26.98,43.89 27.13,43.89 28.04,44.81 28.04,46.79 v29.11,47.85 | v37.19,40.23 39.32,38.1 IC2.6 39.47,37.95 42.98,34.44 v42.98,33.98 | MC68000.17 58.06,7.62 54.86,10.82 v48.77,10.82 | v48.77,13.41 54.71,19.36 54.71,24.38 49.38,29.72 49.38,32.31 v47.7,33.98
  Bottom 0.406: R2.1 22.86,44.2 23.32,43.74 23.32,43.43 v24.08,42.67 | v29.11,47.85 29.41,47.55 29.57,47.55 30.63,46.48 30.63,44.65 31.85,43.43 33.98,43.43 v37.19,40.23 | v48.77,13.41 v48.77,10.82 | v42.98,33.98 v47.7,33.98
N$22  (via drill 0.61)
  Top 0.406: MC68000.18 60.96,10.82 v57.61,14.17 | v44.65,21.49 38.86,21.49 32.61,27.74 23.32,27.74 21.79,29.26 21.79,31.7 26.36,36.27 27.13,36.27 28.04,37.19 28.04,39.17 | 28.04,39.17 30.48,41.6 33.38,41.6 36.73,44.96 36.73,45.72 IC2.10 | 6821_ODD.34 64.77,55.63 62.03,58.37 v62.03,59.44 | v57.91,58.22 56.69,58.22 53.49,55.02 53.49,51.36 55.32,49.53 55.32,44.2 54.25,43.13 54.25,40.69 56.08,38.86 56.08,36.88 60.35,32.61 v63.55,32.61 | v24.23,43.89 23.77,44.35 20.12,44.35 17.98,46.48 17.98,52.58 21.18,55.78 22.86,55.78 R3.1 | v26.82,40.54 28.04,39.32 28.04,39.17
  Bottom 0.406: v44.65,21.49 51.97,14.17 v57.61,14.17 57.61,20.73 64.62,27.74 64.62,31.55 v63.55,32.61 | v62.03,59.44 59.13,59.44 v57.91,58.22 | v24.23,43.89 26.82,41.3 v26.82,40.54
N$23  (via drill 0.61)
  Top 0.406: v20.57,16 20.57,21.64 v21.34,22.4 | v17.37,54.56 19.05,54.56 24.54,60.05 v26.36,60.05 | v42.52,65.53 42.98,65.53 43.28,65.84 v45.57,65.84 | v49.23,72.54 72.69,72.54 v73,72.85
  Bottom 0.406: v20.57,16 18.59,14.02 11.43,14.02 IC1.8 | v21.34,22.4 21.34,23.47 15.7,29.11 15.7,39.62 13.26,42.06 12.8,42.06 11.58,43.28 11.58,48.77 v17.37,54.56 | v26.36,60.05 26.82,60.05 32.31,65.53 v42.52,65.53 | v45.57,65.84 45.57,68.89 v49.23,72.54 | v73,72.85 73.46,72.85 74.37,71.93 75.89,71.93 80.47,67.36 80.47,66.9 81.23,66.14 82.75,66.14 83.52,66.9 83.52,73.3 82.6,74.22 82.6,74.83 2732_ODD.18
N$26  (via drill 0.61)
  Top 0.406: v14.94,45.87 10.97,45.87 v9.3,44.2 | v22.55,20.27 22.55,15.24 29.26,8.53 v29.26,6.1 | v42.06,5.18 50.9,5.18 MC68000.15
  Bottom 0.406: v14.94,45.87 14.94,46.94 17.68,49.68 17.68,52.27 18.29,52.88 18.29,55.93 25.3,62.94 25.3,65.99 U$1.P$8 | v9.3,44.2 9.3,42.67 15.09,36.88 15.09,27.28 22.1,20.27 v22.55,20.27 | v29.26,6.1 29.72,6.1 30.63,5.18 v42.06,5.18
N$27
  Top 0.406: IC2.2 IC2.3 31.85,38.25 31.85,38.86 34.9,41.91 35.2,41.91 39.01,45.72 IC2.9
N$28
  Top 0.406: IC2.11 34.59,45.72 36.42,47.55 40.08,47.55 IC2.8
VCC  (via drill 0.61)
  Top 0.61: RA.2 5.18,59.74 10.06,64.62 10.06,65.99 U$1.P$14 10.36,66.14 10.82,66.6 | 2732_EVEN.24 20.42,76.2 10.82,66.6 | 10.82,66.6 2.59,74.83 X1.1 | IC3.14 29.26,55.93 25.45,55.93 R3.2 25.45,55.63 25.45,48.31 R2.2 | IC2.14 21.18,45.72 19.96,46.94 19.05,46.94 R.2 | v4.27,39.47 5.64,39.47 9.3,43.13 13.87,43.13 D1.C | MC68000.22 MC68000.23 MC68000.24 MC68000.25 | MC68000.12 MC68000.13 MC68000.14 | v49.84,12.65 55.78,18.59 55.78,30.48 MC68000.49 | v55.17,55.32 55.93,54.56 55.93,51.82 57.45,50.29 v57.45,45.11 | v6.71,19.51 6.71,16.31 v16.31,6.71
  Bottom 0.61: 555TIMER.4 12.8,48.16 12.8,44.35 D1.C 14.48,42.67 16.61,42.67 19.05,45.11 R.2 | IC2.14 25.45,46.94 25.45,48.16 R2.2 | 8.69,29.26 11.43,29.26 IC1.14 | 8.69,29.26 1.98,35.97 1.98,39.47 | 1.98,39.47 1.98,52.73 5.03,55.78 555TIMER.8 5.18,56.08 5.18,59.59 RA.2 | 1.98,39.47 v4.27,39.47 | 6821_ODD.20 97.84,38.1 97.84,32.46 98.45,31.85 98.45,25.15 82.75,9.45 80.62,9.45 78.79,7.62 MC68000.25 | v49.84,12.65 49.84,9.3 50.75,8.38 50.75,7.62 MC68000.14 | v55.17,55.32 54.71,55.78 54.71,70.41 55.47,71.17 55.78,71.17 59.44,74.83 67.21,74.83 2732_ODD.24 | v57.45,45.11 60.2,42.37 60.2,41 58.37,39.17 58.37,36.12 55.93,33.68 55.93,30.48 MC68000.49 | MC68000.22 71.02,7.62 67.82,4.42 50.75,4.42 48.31,6.86 48.31,7.62 MC68000.13 | v6.71,19.51 8.53,21.34 8.53,29.11 8.69,29.26 | v16.31,6.71 21.03,1.98 68.73,1.98 73.61,6.86 73.61,7.62 MC68000.23